# EAGLE design v1.0_r3 (EAGLE 9.6.2)
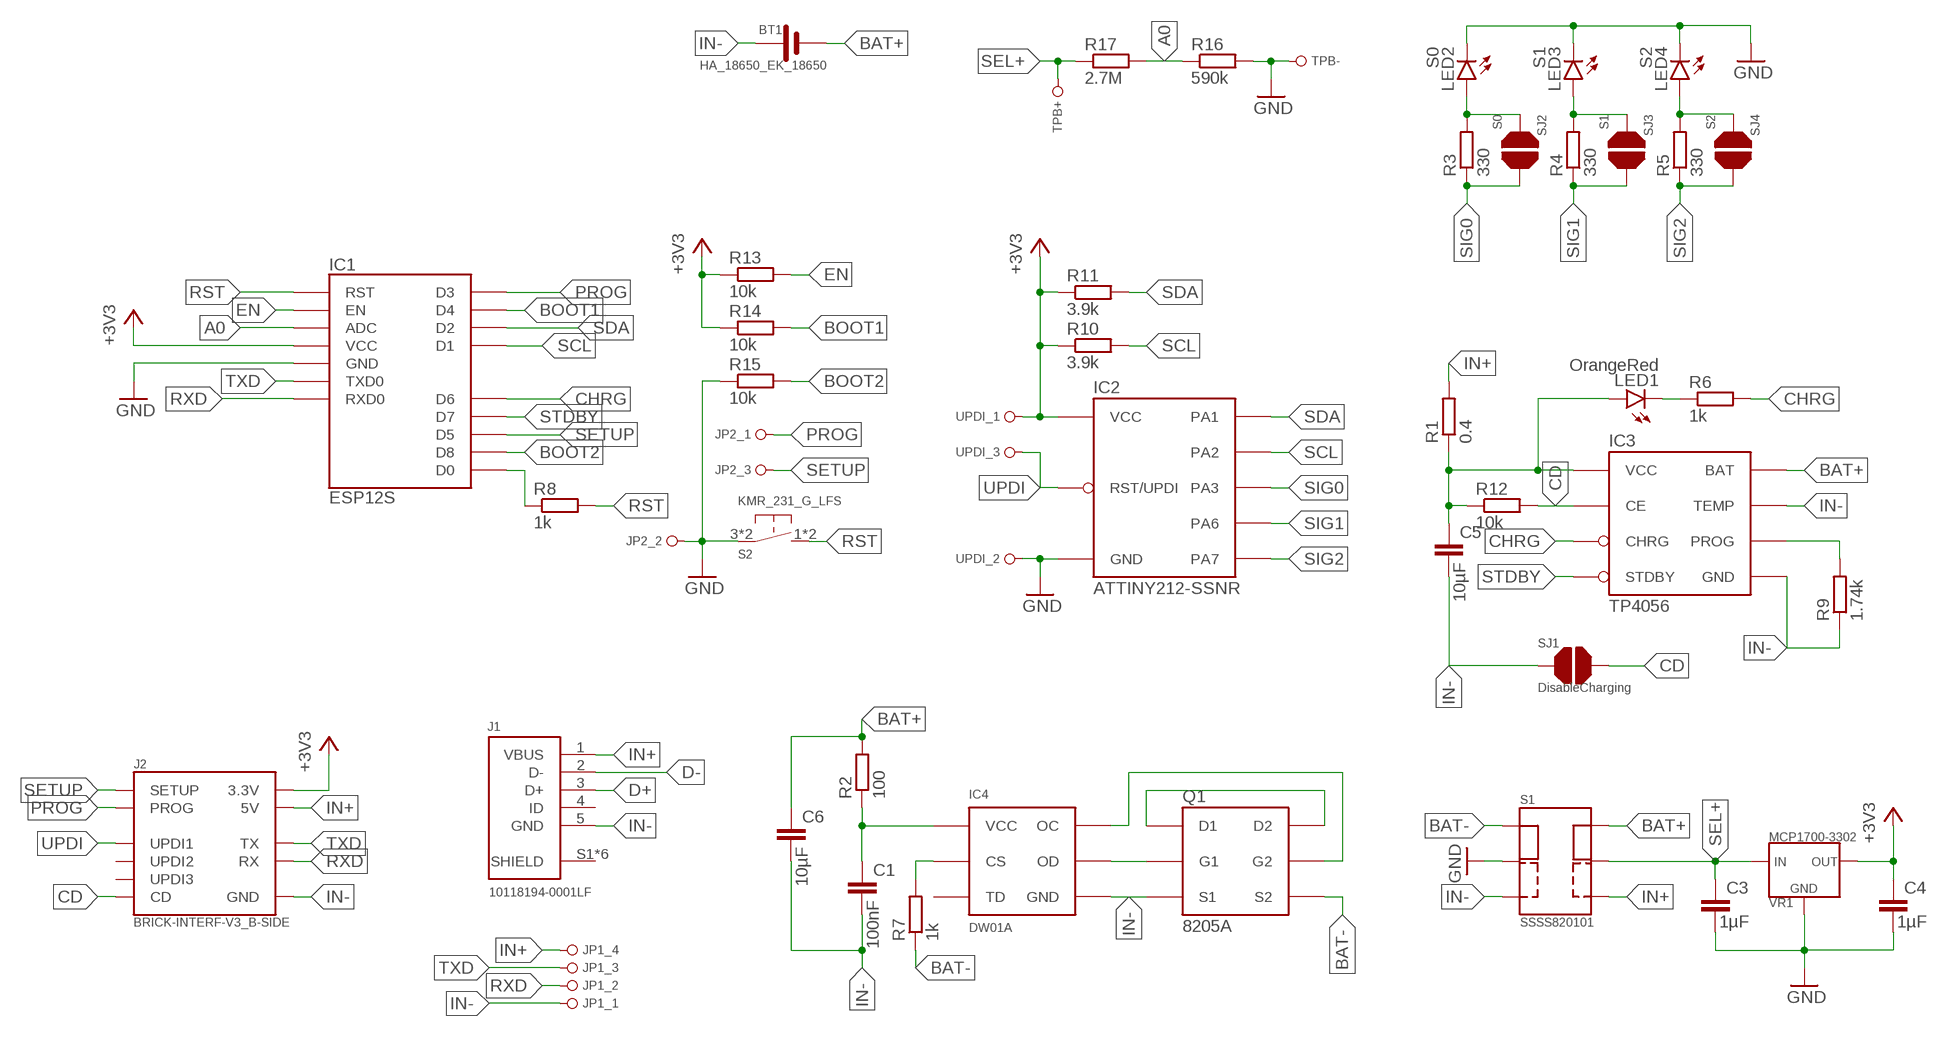
[diagram p0: schematic, sheet 1]

## Parts
BT1  HA_18650_EK_18650  [HA_18650_EK_18650]
C1  100nF  C-EUC0805  [C0805]
C3  1µF  C-EUC0805  [C0805]
C4  1µF  C-EUC0805  [C0805]
C5  10µF  C-EUC0805  [C0805]
C6  10µF  C-EUC0805  [C0805]
IC1  ESP12S  [ESP12S]
IC2  ATTINY212-SSNR  [SOIC8]
IC3  TP4056  [SO8-THERMALPAD]
IC4  DW01A  [SOT23-6]
J1  10118194-0001LF  [10118194-0001LF]
J2  BRICK-INTERF-V3_B-SIDE  [DF9-11P-1V(32)]
JP1  PINHD_1X04_R_1  [1X04_R_1]
JP2  PINHD_1X03_R_1  [1X03_R_1]
LED1  OrangeRed  LEDCHIP-LED0805  [CHIP-LED0805]
LED2  S0  LED5MM  [LED5MM]
LED3  S1  LED5MM  [LED5MM]
LED4  S2  LED5MM  [LED5MM]
Q1  8205A  [TSSOP8]
R1  0.4  R-EU_R0805  [R0805]
R2  100  R-EU_R0805  [R0805]
R3  330  R-EU_R0603  [R0603]
R4  330  R-EU_R0603  [R0603]
R5  330  R-EU_R0603  [R0603]
R6  1k  R-EU_R0805  [R0805]
R7  1k  R-EU_R0805  [R0805]
R8  1k  R-EU_R0805  [R0805]
R9  1.74k  R-EU_R0805  [R0805]
R10  3.9k  R-EU_R0805  [R0805]
R11  3.9k  R-EU_R0805  [R0805]
R12  10k  R-EU_R0805  [R0805]
R13  10k  R-EU_R0805  [R0805]
R14  10k  R-EU_R0805  [R0805]
R15  10k  R-EU_R0805  [R0805]
R16  590k  R-EU_R0805  [R0805]
R17  2.7M  R-EU_R0805  [R0805]
S1  SSSS820101  [SSSS820101]
S2  KMR_231_G_LFS  [KMR_231_G_LFS]
SJ1  DisableCharging  SOLDERJUMPER  [SOLDERJUMPER]
SJ2  S0  SOLDERJUMPER  [SOLDERJUMPER]
SJ3  S1  SOLDERJUMPER  [SOLDERJUMPER]
SJ4  S2  SOLDERJUMPER  [SOLDERJUMPER]
TPB+  PINHD_1X01_S_0.8  [1X01_S_0.8]
TPB-  PINHD_1X01_S_0.8  [1X01_S_0.8]
UPDI  PINHD_1X03_R_1  [1X03_R_1]
VR1  MCP1700-3302  [SOT23]

## Nets
+3V3: C4.1 IC1.VCC IC2.1(VCC) J2.10(3.3V) R10.1 R11.1 R13.1 R14.1 UPDI.1 VR1.2(OUT)
A0: IC1.ADC R16.1 R17.2
BAT+: BT1.P1(PLUS) BT1.P2(PLUS) BT1.P3(PLUS) C6.1 IC3.5(BAT) R2.2 S1.6
BAT-: Q1.6(S2) Q1.7(S2) R7.1 S1.3
BOOT1: IC1.GPIO2(D4) R14.2
BOOT2: IC1.GPIO15(D8) R15.2
CD: IC3.8(CE) J2.5(CD) R12.2 SJ1.2
CHRG: IC1.GPIO12(D6) IC3.7(CHRG) R6.2
D+: J1.3(D+)
D-: J1.2(D-)
EN: IC1.EN R13.2
GND: C3.2 C4.2 IC1.GND IC2.8(GND) JP2.2 LED2.K(C) LED3.K(C) LED4.K(C) R15.1 R16.2 S1.2 S2.3 S2.4 TPB-.1 UPDI.2 VR1.1(GND)
IN+: J1.1(VBUS) J2.4(5V) JP1.4 R1.2 S1.4
IN-: BT1.M1(MINUS) BT1.M2(MINUS) BT1.M3(MINUS) C1.2 C5.2 C6.2 IC3.1(TEMP) IC3.3(GND) IC3.T1(GND) IC3.T2(GND) IC3.T3(GND) IC3.T4(GND) IC3.T5(GND) IC3.T6(GND) IC3.T7(GND) IC3.T8(GND) IC4.6(GND) J1.5(GND) J2.6(GND) JP1.1 Q1.2(S1) Q1.3(S1) R9.1 S1.1 SJ1.1
N$1: C5.1 IC3.4(VCC) LED1.A R1.1 R12.1
N$2: IC3.2(PROG) R9.2
N$3: IC4.2(CS) R7.2
N$4: C1.1 IC4.5(VCC) R2.1
N$5: LED2.A R3.2 SJ2.1
N$6: LED3.A R4.2 SJ3.1
N$7: LED1.C R6.1
N$8: IC4.1(OD) Q1.4(G1)
N$9: LED4.A R5.2 SJ4.1
N$10: Q1.1(D1) Q1.8(D2)
N$11: IC4.3(OC) Q1.5(G2)
PROG: IC1.GPIO0(D3) J2.3(PROG) JP2.1
RST: IC1.RST R8.2 S2.1 S2.2
RXD: IC1.RXD0 J2.11(RX) JP1.2
SCL: IC1.GPIO5(D1) IC2.5(PA2) R10.2
SDA: IC1.GPIO4(D2) IC2.4(PA1) R11.2
SEL+: C3.1 R17.1 S1.5 TPB+.1 VR1.3(IN)
SETUP: IC1.GPIO14(D5) J2.2(SETUP) JP2.3
SIG0: IC2.7(PA3) R3.1 SJ2.2
SIG1: IC2.2(PA6) R4.1 SJ3.2
SIG2: IC2.3(PA7) R5.1 SJ4.2
STDBY: IC1.GPIO13(D7) IC3.6(STDBY)
TXD: IC1.TXD0 J2.1(TX) JP1.3
UPDI: IC2.6(RST/UPDI) J2.7(UPDI1) UPDI.3
WAKE: IC1.GPIO16(D0) R8.1
Unconnected: IC4.4(TD) J1.4(ID) J2.8(UPDI2) J2.9(UPDI3)

## Power pins joined to a net without a drawn wire
SHIELD: J1.S1(SHIELD) J1.S2(SHIELD) J1.S3(SHIELD) J1.S4(SHIELD) J1.S5(SHIELD) J1.S6(SHIELD)

## Library data of the parts
BT1 = no_reichelt:HA_18650_EK
C1 C3-C6 = rcl:C-EU: CAPACITOR, European symbol; SPICEPREFIX: C
IC1 = no_expressif:ESP12S
IC2 = no_microchip:ATTINY212
IC3 = no_reichelt:TP4056
IC4 = no_reichelt:DW01A
J1 = no_reichelt:10118194-0001LF: CONN RCPT USB2.0 MICRO B SMD R/A Manufacturer's datasheet <https://www.amphenol-icc.com/media/wysiwyg/files/drawing/10118194.pdf?__cf_chl_jschl_tk__=1e9b4569481076e99900b246ea640525553a7b60-1588047333-0-AZhEk6D50lwOf6CdaXmV1teudqMKHMxqtb1pEtnUtu77sOc-OVRjbCmHdORomVnr0W49D2E8XkcMdJ2SdWt5rDDYIblyJz7fSv-zilM8vQKAQDC1Z9aMVORhnMgYjPDuz8XpfDLul_eaqqFpemo1xIgoZv50WTuLMwu26ci7e02s9PWvR3z1cDqm9GMGYIPwIUd9yh5-TtN_o6DbEkadC7zoJlhYZSw-VEaYzfWnBSFg_n44fbEB3slHLR2YKLSiTmh8RSwpxKUP4gER0KeVoie9w-Ibtx3oKQbsZjrsPLGSu9BzV2nf3QeoErALCQuycvY9WhQdebLIpxaon6SXufpVIIdoKZHRpjuVVlAkUIr9oSIZGQzzOWY1-dWY48jVEOvnvoxw9-xup5uFcr7XWo0>; CREATED_BY: PCBLayout.com; DIGIKEY_PARTNO: 609-4618-2-ND; MANUFACTURER: Amphenol ICC (FCI); MPN: 10118194-0001LF
J2 = no_brick_interface:BRICK-INTERF-V3
JP1 = no_pinhd:PINHD_1X04; DRILL: 1mm; PADSHAPE: round
JP2 UPDI = no_pinhd:PINHD_1X03; DRILL: 1mm; PADSHAPE: round
LED1-LED4 = led:LED: LED OSRAM: - CHIPLED LG R971, LG N971, LY N971, LG Q971, LY Q971, LO R971, LY R971 LH N974, LH R974 LS Q976, LO Q976, LY Q976 LO Q996 - Hyper CHIPLED LW Q18S LB Q993, LB Q99A, LB R99A - SideLED LS A670, LO A670, LY A670, LG A670, LP A670 LB A673, LV A673, LT A673, LW A673 LH A674 LY A675 LS A676, LA A676, LO A676, LY A676, LW A676 LS A679, LY A679, LG A679 - Hyper Micro SIDELED® LS Y876, LA Y876, LO Y876, LY Y876 LT Y87S - SmartLED LW L88C, LW L88S LB L89C, LB L89S, LG L890 LS L89K, LO L89K, LY L89K LS L896, LA L896, LO L896, LY L896 - TOPLED LS T670, LO T670, LY T670, LG T670, LP T670 LSG T670, LSP T670, LSY T670, LOP T670, LYG T670 LG T671, LOG T671, LSG T671 LB T673, LV T673, LT T673, LW T673 LH T674 LS T676, LA T676, LO T676, LY T676, LB T676, LH T676, LSB T676, LW T676 LB T67C, LV T67C, LT T67C, LS T67K, LO T67K, LY T67K, LW E67C LS E67B, LA E67B, LO E67B, LY E67B, LB E67C, LV E67C, LT E67C LW T67C LS T679, LY T679, LG T679 LS T770, LO T770, LY T770, LG T770, LP T770 LB T773, LV T773, LT T773, LW T773 LH T774 LS E675, LA E675, LY E675, LS T675 LS T776, LA T776, LO T776, LY T776, LB T776 LHGB T686 LT T68C, LB T68C - Hyper Mini TOPLED® LB M676 - Mini TOPLED Santana® LG M470 LS M47K, LO M47K, LY M47K Source: http://www.osram.convergy.de LUXEON: - LUMILED® LXK2-PW12-R00, LXK2-PW12-S00, LXK2-PW14-U00, LXK2-PW14-V00 LXK2-PM12-R00, LXK2-PM12-S00, LXK2-PM14-U00 LXK2-PE12-Q00, LXK2-PE12-R00, LXK2-PE12-S00, LXK2-PE14-T00, LXK2-PE14-U00 LXK2-PB12-K00, LXK2-PB12-L00, LXK2-PB12-M00, LXK2-PB14-N00, LXK2-PB14-P00, LXK2-PB14-Q00 LXK2-PR12-L00, LXK2-PR12-M00, LXK2-PR14-Q00, LXK2-PR14-R00 LXK2-PD12-Q00, LXK2-PD12-R00, LXK2-PD12-S00 LXK2-PH12-R00, LXK2-PH12-S00 LXK2-PL12-P00, LXK2-PL12-Q00, LXK2-PL12-R00 Source: www.luxeon.com KINGBRIGHT: KA-3528ASYC Source: www.kingbright.com
Q1 = no_reichelt:8205A
R1-R17 = rcl:R-EU_: RESISTOR, European symbol; SPICEPREFIX: R
S1 = no_reichelt:SSSS820101
S2 = no_reichelt:KMR_231_G_LFS
SJ1-SJ4 = no_pinhd:SOLDERJUMPER
TPB+ TPB- = no_pinhd:PINHD_1X01; DRILL: 0.8mm; PADSHAPE: square
VR1 = no_reichelt:MCP170

## Board
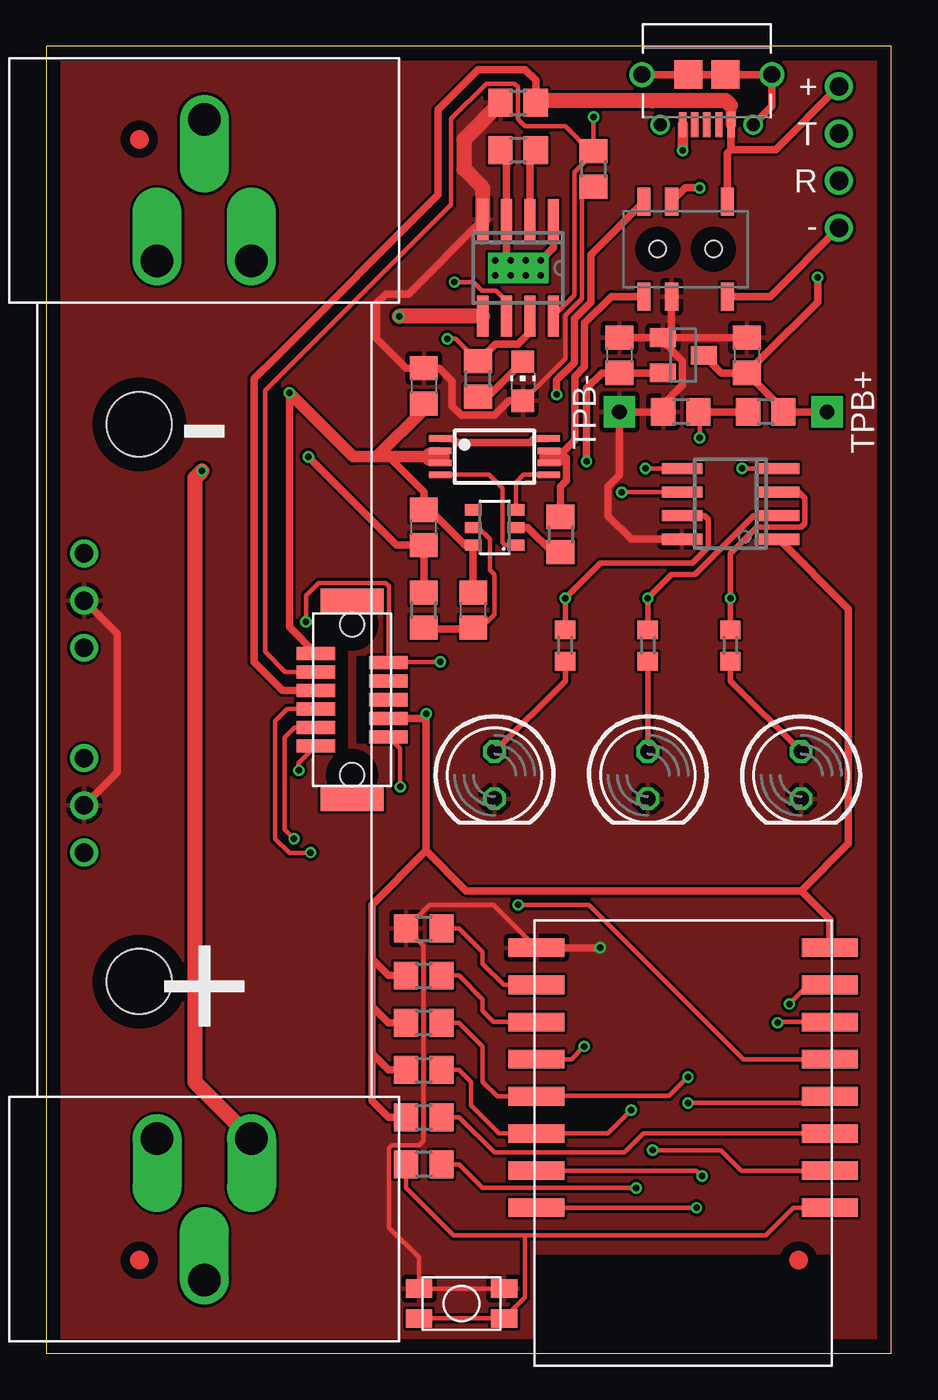
[diagram p1: board, top side]
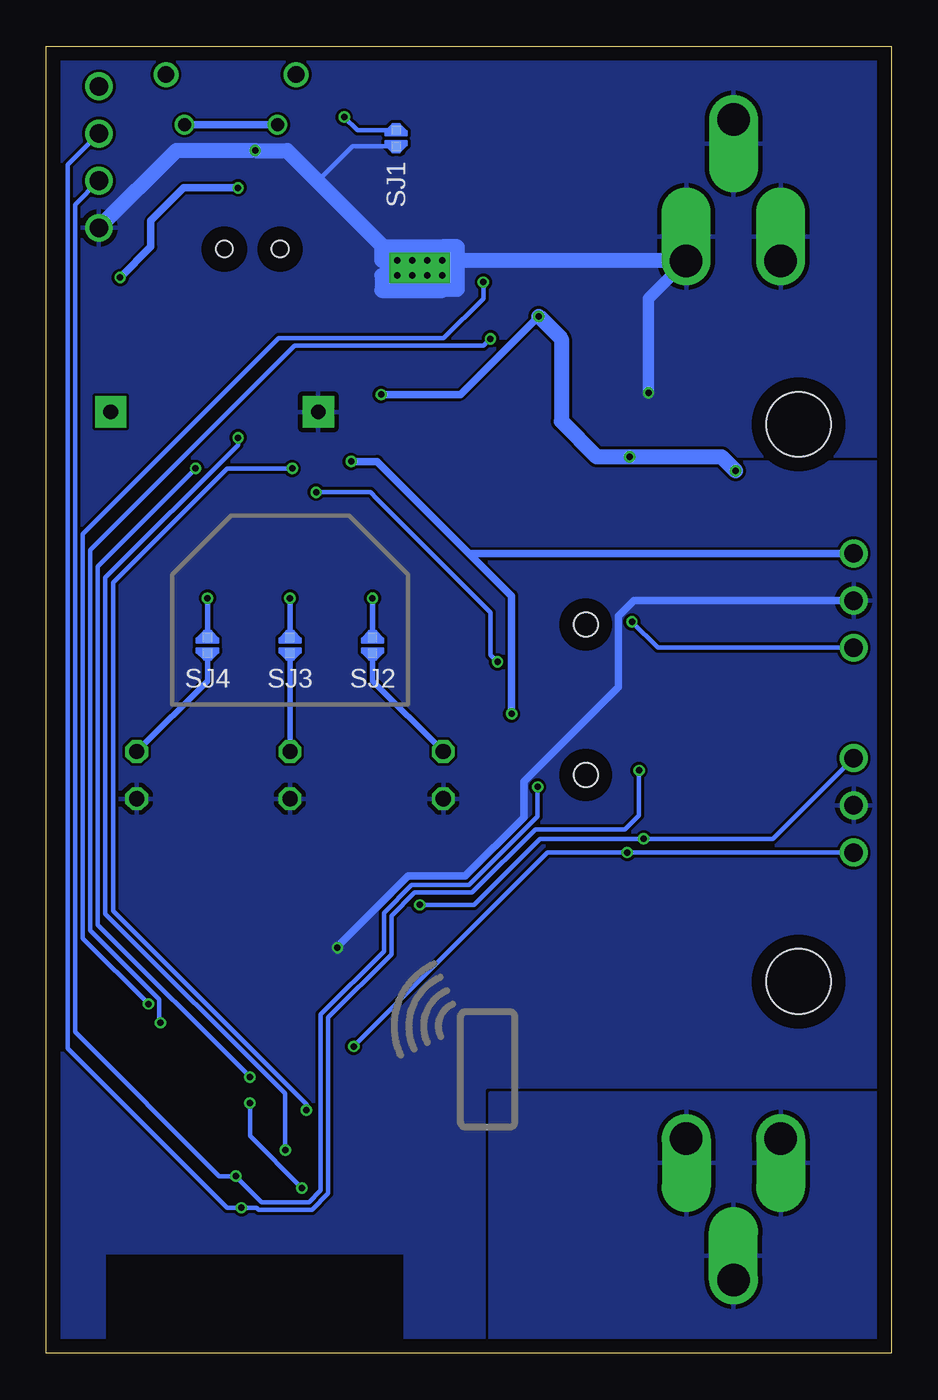
[diagram p2: board, bottom side, seen from below]

Size 45.5 x 70.35 mm. Coordinates in mm from the lower left corner, seen from the top.
Outline: 0,0 45.5,0 45.5,70.35 0,70.35 0,0
Copper layers (1*16): Top 0.035mm / dielectric 1.5mm / Bottom 0.035mm
Design rules "JLCPCB": minimum track width 6mil, minimum drill 0.2mm, track to track 6mil, track to pad 6mil, pad to pad 6mil, via to via 6mil, smd to smd 6mil, copper to edge 30mil, drill to drill 8mil, minimum pad ring 0.13mm, minimum via ring 0.13mm, stop-mask expansion 4mil, vias tented up to drill 0mil, thermal gap 10mil
Holes 3.5 mm at 5,20 5,50

### Footprints (pad centres in the part's own frame; a part is rotated, then mirrored left to right if it is on the bottom)
HA_18650_EK_18650 = drill 1.75 offset: M1 0,-31.25; M2 2.54,-23.63; M3 -2.54,-23.63; P1 0,31.25; P2 -2.54,23.63; P3 2.54,23.63
C0805 = smd 1.3 x 1.5: 1 -0.95,0; 2 0.95,0
ESP12S = smd 3 x 1: ADC -7.9,1.48; EN -7.9,-0.52; GND 7.9,-10.52; GPIO0 7.9,-4.52; GPIO2 7.9,-6.52; GPIO4 7.9,-2.52; GPIO5 7.9,-0.52; GPIO12 -7.9,-6.52; GPIO13 -7.9,-8.52; GPIO14 -7.9,-4.52; GPIO15 7.9,-8.52; GPIO16 -7.9,-2.52; RST -7.9,3.48; RXD0 7.9,1.48; TXD0 7.9,3.48; VCC -7.9,-10.52
SOIC8 = smd 0.6 x 2.2: 1 -1.905,-2.6; 2 -0.635,-2.6; 3 0.635,-2.6; 4 1.905,-2.6; 5 1.905,2.6; 6 0.635,2.6; 7 -0.635,2.6; 8 -1.905,2.6
SO8-THERMALPAD = smd 0.6 x 2.2: 1 -1.905,-2.6; 2 -0.635,-2.6; 3 0.635,-2.6; 4 1.905,-2.6; 5 1.905,2.6; 6 0.635,2.6; 7 -0.635,2.6; 8 -1.905,2.6 | drill 0.35 pad 0.813 square: T1 -1.219,0.406; T2 -0.406,0.406; T3 0.406,0.406; T4 1.219,0.406; T5 -1.219,-0.406; T6 -0.406,-0.406; T7 0.406,-0.406; T8 1.219,-0.406
SOT23-6 = smd 0.6 x 0.9: 1 -0.95,-1.15; 2 0,-1.15; 3 0.95,-1.15; 4 0.95,1.15; 5 0,1.15; 6 -0.95,1.15
10118194-0001LF = smd 0.4 x 1.35: 1 -1.3,2.7; 2 -0.65,2.7; 3 0,2.7; 4 0.65,2.7; 5 1.3,2.7 | drill 0.7: S1 -2.5,2.7; S2 2.5,2.7 | drill 0.9: S3 -3.5,0; S6 3.5,0 | smd 1.5 x 1.55: S4 -1,0; S5 1,0
DF9-11P-1V(32) = smd 0.7 x 2.08: 1 2.5,-1.96; 2 1.5,-1.96; 3 0.5,-1.96; 4 -0.5,-1.96; 5 -1.5,-1.96; 6 -2.5,-1.96; 7 -2,1.96; 8 -1,1.96; 9 0,1.96; 10 1,1.96; 11 2,1.96 | smd 1.3 x 3.4: S1 5.35,0; S2 -5.35,0 | hole 1.3: 4.05,0; -4.05,0
1X04_R_1 = drill 1: 1 -3.81,0; 2 -1.27,0; 3 1.27,0; 4 3.81,0
1X03_R_1 = drill 1: 1 -2.54,0; 2 0,0; 3 2.54,0
CHIP-LED0805 = smd 1.2 x 1.2: A 0,-1.05; C 0,1.05
LED5MM = drill 0.813 octagon: A -1.27,0; K 1.27,0
TSSOP8 = smd 1.2 x 0.35: 1 -2.925,0.975; 2 -2.925,0.325; 3 -2.925,-0.325; 4 -2.925,-0.975; 5 2.925,-0.975; 6 2.925,-0.325; 7 2.925,0.325; 8 2.925,0.975
R0805 = smd 1.3 x 1.5: 1 -0.95,0; 2 0.95,0
R0603 = smd 1 x 1.1: 1 -0.85,0; 2 0.85,0
SSSS820101 = smd 1.5 x 0.7: 1 -2.55,-2.25; 2 -2.55,0.75; 3 -2.55,2.25; 4 2.55,-2.25; 5 2.55,0.75; 6 2.55,2.25 | hole 0.9: 0,1.5; 0,-1.5
KMR_231_G_LFS = smd 1 x 1.4: 1 -0.8,2.3; 2 -0.8,-2.3; 3 0.8,-2.3; 4 0.8,2.3
SOLDERJUMPER = smd 0.508 x 0.508: 1 -0.432,0; 2 0.432,0
1X01_S_0.8 = drill 0.8 pad 1.676 square: 1 0,0
SOT23 = smd 1 x 1.4: 1 -0.95,-1.1; 2 0.95,-1.1; 3 0,1.1

### Placement (x,y rotation side)
BT1  8.5,35.17 180 top
C1  22.99,40.01 90 top
C3  37.72,53.72 90 top
C4  30.86,53.72 90 top
C5  20.32,52.07 270 top
C6  20.32,44.45 90 top
FD1  [FIDUCIAL]  5,65.35 0 top
FD2  [FIDUCIAL]  5,5 0 top
FD3  [FIDUCIAL]  40.5,5 0 top
IC1  34.29,11.3 180 top
IC2  36.83,45.72 90 top
IC3  25.4,58.42 180 top
IC4  24.13,44.45 90 top
J1  35.56,68.83 180 top
J2  16.46,35.17 270 top
JP1  42.67,64.39 90 top
JP2  2.03,29.49 90 top
LED1  25.65,52.32 0 top
LED2  24.13,31.11 270 top
LED3  32.38,31.11 270 top
LED4  40.64,31.11 270 top
Q1  24.13,48.26 0 top
R1  25.4,67.31 0 top
R2  20.32,40.01 90 top
R3  27.94,38.1 270 top
R4  32.38,38.1 270 top
R5  36.83,38.1 270 top
R6  23.24,52.45 90 top
R7  27.69,44.07 270 top
R8  20.32,10.16 180 top
R9  25.4,64.77 0 top
R10  20.32,15.24 0 top
R11  20.32,17.78 0 top
R12  29.46,63.75 90 top
R13  20.32,12.7 0 top
R14  20.32,20.32 0 top
R15  20.32,22.86 0 top
R16  34.16,50.67 180 top
R17  38.73,50.67 180 top
S1  34.42,59.44 90 top
S2  22.35,2.67 90 top
SJ1  26.67,65.41 90 bottom
SJ2  27.94,38.1 90 bottom
SJ3  32.38,38.1 90 bottom
SJ4  36.83,38.1 90 bottom
TPB+  42.04,50.67 0 top
TPB-  30.86,50.67 0 top
U$1  [BRICKS_LOGO_20]  16.51,5.08 90 bottom
UPDI  2.03,40.51 270 top
VR1  34.29,53.72 270 top

### Tracks (layer width: path | path; a pad name or v marks a point on that pad's centre or on a via)
+3V3  (via drill 0.35)
  Top 0.406: IC1.VCC 42.19,23.34 40.64,24.89 | 17.53,16.13 18.41,15.24 R10.1 | 17.53,18.67 18.41,17.78 R11.1 | R14.1 18.41,20.32 17.53,21.21 | 17.53,16.13 17.53,13.59 18.41,12.7 R13.1 | 17.53,16.13 17.53,18.67 | 17.53,18.67 17.53,21.21 | VR1.2 C4.1 29.91,52.77 29.08,51.94 v29.08,48.01 | J2.10 20.2,34.17 v20.45,34.42 20.45,27.05 | 20.45,27.05 17.53,24.13 17.53,21.21 | 20.45,27.05 22.61,24.89 40.64,24.89 | 40.64,24.89 43.18,27.43 43.18,40.06 IC2.1
  Bottom 0.406: 22.73,43.05 UPDI.1 | v29.08,48.01 27.69,48.01 22.73,43.05 | 22.73,43.05 20.45,40.77 v20.45,34.42
A0  (via drill 0.35)
  Top 0.254: IC1.ADC 37.42,9.82 36.32,10.92 v32.64,10.92 | v35.18,49.28 35.18,50.61 R16.1
  Top 0.406: R17.2 R16.1
  Bottom 0.254: v32.64,10.92 32.64,13.97 42.33,23.66 42.33,41.75 35.18,48.9 v35.18,49.28
BAT+  (via drill 0.35)
  Top 0.406: R2.2 C6.1 18.86,43.5 v14.1,48.26 | S1.6 29.32,59.14 29.32,56.58 28.42,55.68 28.42,53.33 27.48,52.39 v27.48,51.6
  Top 0.813: IC3.5 v18.99,55.82 | v8.38,47.5 8,47.12 8,14.58 BT1.P2
  Bottom 0.406: v27.48,51.6 23.2,51.6 v18.99,55.82
  Bottom 0.813: v18.99,55.82 17.78,54.61 17.78,50.16 15.88,48.26 v14.1,48.26 9.14,48.26 v8.38,47.5
  pour Bottom: 0,0 21.59,0 21.59,13.97 0,13.97
BAT-
  Top 0.203: Q1.7 27.05,48.26 Q1.6
  Top 0.406: R7.1 27.69,46.64 28.01,46.96 28.01,48.18 27.94,48.25 27.57,48.25 27.56,48.26 28.45,49.15 28.45,52.57 28.98,53.1 28.98,55.45 30.42,56.89 S1.3
  Top 1.016: 27.05,48.26 27.56,48.26
BOOT1
  Top 0.254: R14.2 22.23,20.32 23.5,19.05 23.5,18.41 24.09,17.82 IC1.GPIO2
BOOT2
  Top 0.254: IC1.GPIO15 24.63,19.82 23.5,20.95 23.5,21.59 22.23,22.86 R15.2
CD  (via drill 0.35)
  Top 0.254: R12.2 29.46,64.6 28.43,63.57 28.43,56.95 IC3.8 | R12.2 29.28,64.7 27.94,66.04 25.78,66.04 25.38,66.44 25.38,68.18 25.22,68.34 23.68,68.34 21.79,66.45 21.79,61.84 11.77,51.81 11.77,37.76 12.86,36.67 J2.5 | R12.2 v29.46,66.55
  Bottom 0.254: SJ1.2 28.75,65.84 v29.46,66.55
CHRG  (via drill 0.35)
  Top 0.254: v21.59,54.61 22.03,54.61 R6.2 | v39.37,17.78 39.41,17.82 IC1.GPIO12
  Top 0.406: IC3.7 26.04,54.97 25.4,54.33 24.17,54.33 R6.2
  Bottom 0.254: v21.59,54.61 21.97,54.23 32.13,54.23 43.14,43.22 43.14,22.75 39.42,19.04 39.42,17.83 v39.37,17.78
EN
  Top 0.254: IC1.EN 32.14,11.82 31.11,10.79 24.13,10.79 22.23,12.7 R13.2
GND  (via drill 0.35)
  Top 0.254: IC1.GND 24.08,24.13 20.64,24.13 R15.1 20.3,21.93 20.3,11.43 20.06,11.19 18.6,11.19 18.44,11.03 18.44,8.49 18.44,8.26 18.44,6.75 20.05,5.14 S2.4 S2.3
  Top 0.406: JP2.2 3.81,31.27 3.81,38.73 UPDI.2 | S1.2 33.67,55.15 VR1.1 | C3.2 VR1.1 | C4.2 VR1.1 | VR1.1 33.19,54.47 34.25,53.42 34.25,52.12 33.21,51.09 R16.2 TPB-.1 30.86,47.27 30.24,46.65 30.24,45.07 31.5,43.81 IC2.8 | IC1.GND v29.82,21.82
  Bottom 0.406: v29.82,21.82 29.82,21.89 26.04,25.68 22.95,25.68 19.78,28.84 19.78,30.78 14.7,35.86 14.7,39.67 13.87,40.51 UPDI.2
  pour Bottom (rank 2): 0,0 45.5,0 45.5,70.35 0,70.35
  pour Top (rank 2): 0,0 45.5,0 45.5,70.35 0,70.35
IN+
  Top 0.406: J1.1 36.86,64.8 | 36.86,64.8 39.27,64.8 JP1.4 | R1.2 26.35,68.52 25.78,69.09 23.24,69.09 21.08,66.93 21.08,62.36 12.38,53.66 11.18,52.45 11.18,37.21 12.71,35.67 J2.4 | S1.4 36.67,64.61 36.86,64.8
  Top 0.559: J1.1 36.86,67.15 36.83,67.18
  Top 0.813: 36.83,67.18 36.58,67.44 32.67,67.44 32.65,67.41 26.45,67.41 R1.2
IN-  (via drill 0.35)
  Top 0.254: Q1.2 21.2,48.26 Q1.3
  Top 0.406: R9.1 24.77,64.45 IC3.3 24.77,59.05 IC3.T7 | 17.78,48.26 18.41,48.26 20.32,46.35 C6.2 20.64,45.4 22.54,43.5 IC4.6 C1.2 | IC3.T7 IC3.T6 IC3.T5 27.3,59.51 IC3.1 | IC3.T7 IC3.T8 IC3.T4 IC3.T3 IC3.T2 IC3.T1 | JP1.1 38.98,56.89 S1.1 | J2.6 13.08,39.09 v13.08,51.69
  Top 0.559: J1.5 v34.26,64.74
  Top 0.61: C5.2 20.32,50.8 17.78,48.26 | 20.7,48.26 17.78,48.26 | 17.78,48.26 16.51,48.26 v13.08,51.69
  Top 1.016: 21.2,48.26 20.7,48.26
  Bottom 0.254: SJ1.1 29.01,64.97 30.89,63.09
  Bottom 0.61: BT1.M3 13.08,56.76 v13.08,51.69
  Bottom 0.813: IC3.T3 24.99,57.21 | 24.99,57.21 24.18,57.21 IC3.T4 24.18,57.28 23.37,57.28 23.37,58.83 | IC3.T2 25.81,57.21 | 25.81,57.21 24.99,57.21 | IC3.T1 27.43,58.01 27.43,57.21 25.81,57.21 | IC3.T8 24.18,59.56 | 24.18,59.56 23.37,59.56 23.37,58.83 | IC3.T7 24.99,59.56 | 24.99,59.56 24.18,59.56 | IC3.T6 25.81,59.56 | 25.81,59.56 24.99,59.56 | 25.81,59.56 27.43,59.56 27.43,58.83 IC3.T5 30.89,63.09 32.53,64.74 v34.26,64.74 38.51,64.74 JP1.1 | IC3.T8 23.37,58.83 | BT1.M3 24.16,58.8 IC3.T8
  pour Bottom: 0,70.35 0,48.26 15.88,48.26 17.78,50.16 17.78,54.61 19.05,55.88 20.32,54.61 33.02,54.61 45.5,41.91 45.5,55.88 45.5,70.35
N$1
  Top 0.254: LED1.A 25.68,51.27 27.94,53.53 27.94,55.88 28.84,56.78 28.84,62.18 R12.1
  Top 0.406: LED1.A 24.92,51.27 24.14,50.49 22.34,50.49 21.84,50.99 21.84,52.32 21.15,53.02 C5.1 19.37,53.02 17.78,54.61 17.78,56.52 18.29,57.02 19.5,57.02 IC3.4
  Top 0.813: R1.1 22.48,65.34 22.48,63.75 23.5,62.74 IC3.4
  pour Top: 23.5,69.22 20.95,66.67 20.95,62.87 12.7,54.61 12.7,51.44 13.34,51.44 16.51,48.26 18.41,48.26 27.3,48.26 28.57,49.53 28.57,62.87 29.21,63.5 29.21,64.14 29.21,69.22
N$2
  Top 0.406: R9.2 26.04,64.45 IC3.2
N$3
  Top 0.406: IC4.2 25.91,44.45 27.24,43.12 R7.2
N$4
  Top 0.254: IC4.5 23.24,44.45 23.88,43.81 23.88,42.16 24.13,41.91 24.13,39.75 23.43,39.05 C1.1
  Top 0.406: R2.1 20.39,38.99 22.92,38.99 C1.1
N$5
  Top 0.305: R3.2 27.94,36.2 LED2.A
  Bottom 0.305: SJ2.1 27.94,36.2 LED2.A
N$6
  Top 0.305: R4.2 LED3.A
  Bottom 0.305: SJ3.1 LED3.A
N$7
  Top 0.406: R6.1 23.78,51.5 LED1.C
N$8
  Top 0.254: Q1.4 23.84,47.28 24.55,46.57 24.55,44.45 24.55,44.03 24.55,43.65 24.7,43.5 IC4.1
N$9
  Top 0.305: R5.2 36.83,36.2 LED4.A
  Bottom 0.305: SJ4.1 36.83,36.2 LED4.A
N$10
  Top 0.406: Q1.1 21.89,49.23 22.1,49.02 26.04,49.02 26.25,49.23 Q1.8
N$11
  Top 0.254: Q1.5 25.7,47.28 25.28,46.87 IC4.3
PROG  (via drill 0.35)
  Top 0.254: IC1.GPIO0 28.27,15.82 v28.96,16.51 | J2.3 12.96,34.67 12.32,34.04 12.32,27.69 13.08,26.92 14.2,26.92 v14.22,26.95
  Bottom 0.254: v28.96,16.51 18.52,26.95 v14.22,26.95 JP2.1
RST
  Top 0.254: IC1.RST 40.21,7.82 38.73,6.35 25.78,6.35 | 25.78,6.35 22.86,6.35 21.91,6.35 19.37,8.89 R8.2 | S2.1 S2.2 25.78,3 25.78,6.35
RXD  (via drill 0.35)
  Top 0.254: v35.31,9.53 35.01,9.82 IC1.RXD0 | J2.11 19.05,32.54 v19.05,30.48
  Bottom 0.254: JP1.2 43.95,61.84 43.95,17.28 36.2,9.53 v35.31,9.53 33.91,8.13 31.37,8.13 30.73,8.76 30.73,18.23 27.33,21.63 27.33,23.7 25.84,25.19 22.75,25.19 19.05,28.9 v19.05,30.48
SCL  (via drill 0.35)
  Top 0.254: v32.26,47.62 IC2.5 | v31.5,13.08 30.24,11.82 IC1.GPIO5 24.37,11.82 22.86,13.34 22.86,14.61 22.23,15.24 R10.2
  Bottom 0.254: v32.26,47.62 35.76,47.62 41.91,41.48 41.91,23.82 31.5,13.4 v31.5,13.08
SDA  (via drill 0.35)
  Top 0.254: v34.54,14.86 33.53,13.84 26.41,13.84 IC1.GPIO4 24.28,13.82 23.5,14.61 23.5,16.51 22.23,17.78 R11.2 | v37.47,47.62 IC2.4
  Bottom 0.254: v34.54,14.86 42.73,23.05 42.73,42.36 v37.47,47.62
SEL+  (via drill 0.35)
  Top 0.406: C3.1 38.61,53.66 38.62,53.66 41.53,56.58 v41.53,57.91 | v35.18,62.74 34.42,62.74 S1.5 | C3.1 36.34,52.77 VR1.3 | TPB+.1 R17.1 39.69,50.8 C3.1
  Bottom 0.406: v41.53,57.91 39.88,59.56 39.88,60.96 38.1,62.74 v35.18,62.74
SETUP  (via drill 0.35)
  Top 0.254: J2.2 13.35,33.67 12.83,33.15 12.83,28.19 v13.34,27.69 | v25.4,24.13 29.21,24.13 37.52,15.82 IC1.GPIO14
  Bottom 0.254: JP2.3 6.38,27.69 v13.34,27.69 18.92,27.69 22.48,24.13 v25.4,24.13
SHIELD
  Top 0.406: J1.S6 J1.S5 J1.S4 J1.S3 39.06,67.13 J1.S1
  Bottom 0.406: J1.S1 J1.S2
SIG0  (via drill 0.35)
  Top 0.305: R3.1 v27.94,40.64 29.84,42.55 34.79,42.55 35.63,43.39 35.63,44.88 35.43,45.09 IC2.7
  Bottom 0.305: SJ2.2 v27.94,40.64
SIG1  (via drill 0.35)
  Top 0.305: R4.1 v32.38,40.64 33.66,41.91 34.92,41.91 38.1,45.09 IC2.2
  Bottom 0.305: SJ3.2 v32.38,40.64
SIG2  (via drill 0.35)
  Top 0.305: R5.1 v36.83,40.64 36.83,43.05 38.26,44.48 40.66,44.48 40.84,44.66 40.84,46.03 40.51,46.35 IC2.3
  Bottom 0.305: SJ4.2 v36.83,40.64
STDBY  (via drill 0.35)
  Top 0.254: v21.97,57.66 22.99,57.66 23.45,57.2 24.21,57.2 24.77,56.64 IC3.6 | v40.01,18.8 41.03,19.82 IC1.GPIO13
  Bottom 0.254: v21.97,57.66 21.97,56.77 24.11,54.63 32.99,54.63 43.54,44.09 43.54,22.34 v40.01,18.8
TXD  (via drill 0.35)
  Top 0.254: IC1.TXD0 v35,7.82 | J2.1 13.59,31.77 v13.59,31.37
  Bottom 0.254: JP1.3 44.36,63.97 44.36,16.42 35.76,7.82 v35,7.82 34.18,7.82 34.08,7.72 31.2,7.72 30.33,8.6 30.33,18.06 26.92,21.46 26.92,23.54 25.67,24.79 22.58,24.79 19.18,28.19 14.35,28.19 13.59,28.96 v13.59,31.37
UPDI  (via drill 0.35)
  Top 0.254: v21.21,37.21 18.45,37.21 J2.7 18.42,39.74 18.44,39.76 18.44,41.29 18.27,41.45 14.64,41.45 13.97,40.78 v13.97,39.37 | IC2.6 30.99,46.35 v30.98,46.34
  Bottom 0.254: v21.21,37.21 21.59,37.59 21.59,39.88 27.69,45.97 28.06,46.34 v30.98,46.34 | UPDI.3 12.57,37.97 v13.97,39.37
WAKE  (via drill 0.35)
  Top 0.254: IC1.GPIO16 41.83,13.46 v34.54,13.46 | R8.1 22.23,10.16 23.5,8.89 v31.75,8.89
  Bottom 0.254: v34.54,13.46 34.54,11.68 v31.75,8.89

### Text on the board
tNames: + | T | R | -
tDocu: BAT | USB | by NiJO's | 3V3 | B-Int | GND | UPDI | NAHS-SignalBrick | SETUP | GND | v3.0 | PROG | v1.0 R3 | RST
bDocu: IN+ | TXD | Disable / Charging | RXD | IN- | by NiJO's | 3V3 | GND | Signal / Passthrough | UPDI | NAHS-SignalBrick | SETUP | GND | PROG | v1.0 R3